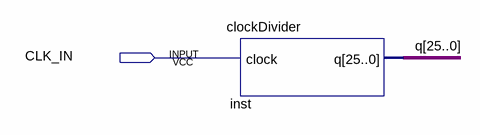
[diagram p0: schematic sheet]
// Quartus schematic Clock.bdf as structural Verilog: 1 symbols, 1 pins
module Clock (
  input  CLK_IN
);

  wire [25:0] q;

  clockDivider inst (.clock(CLK_IN), .q(q));
endmodule
